# EAGLE design Main Board v2 (EAGLE 9.6.2)

## Sheet 1 of 2: High Power
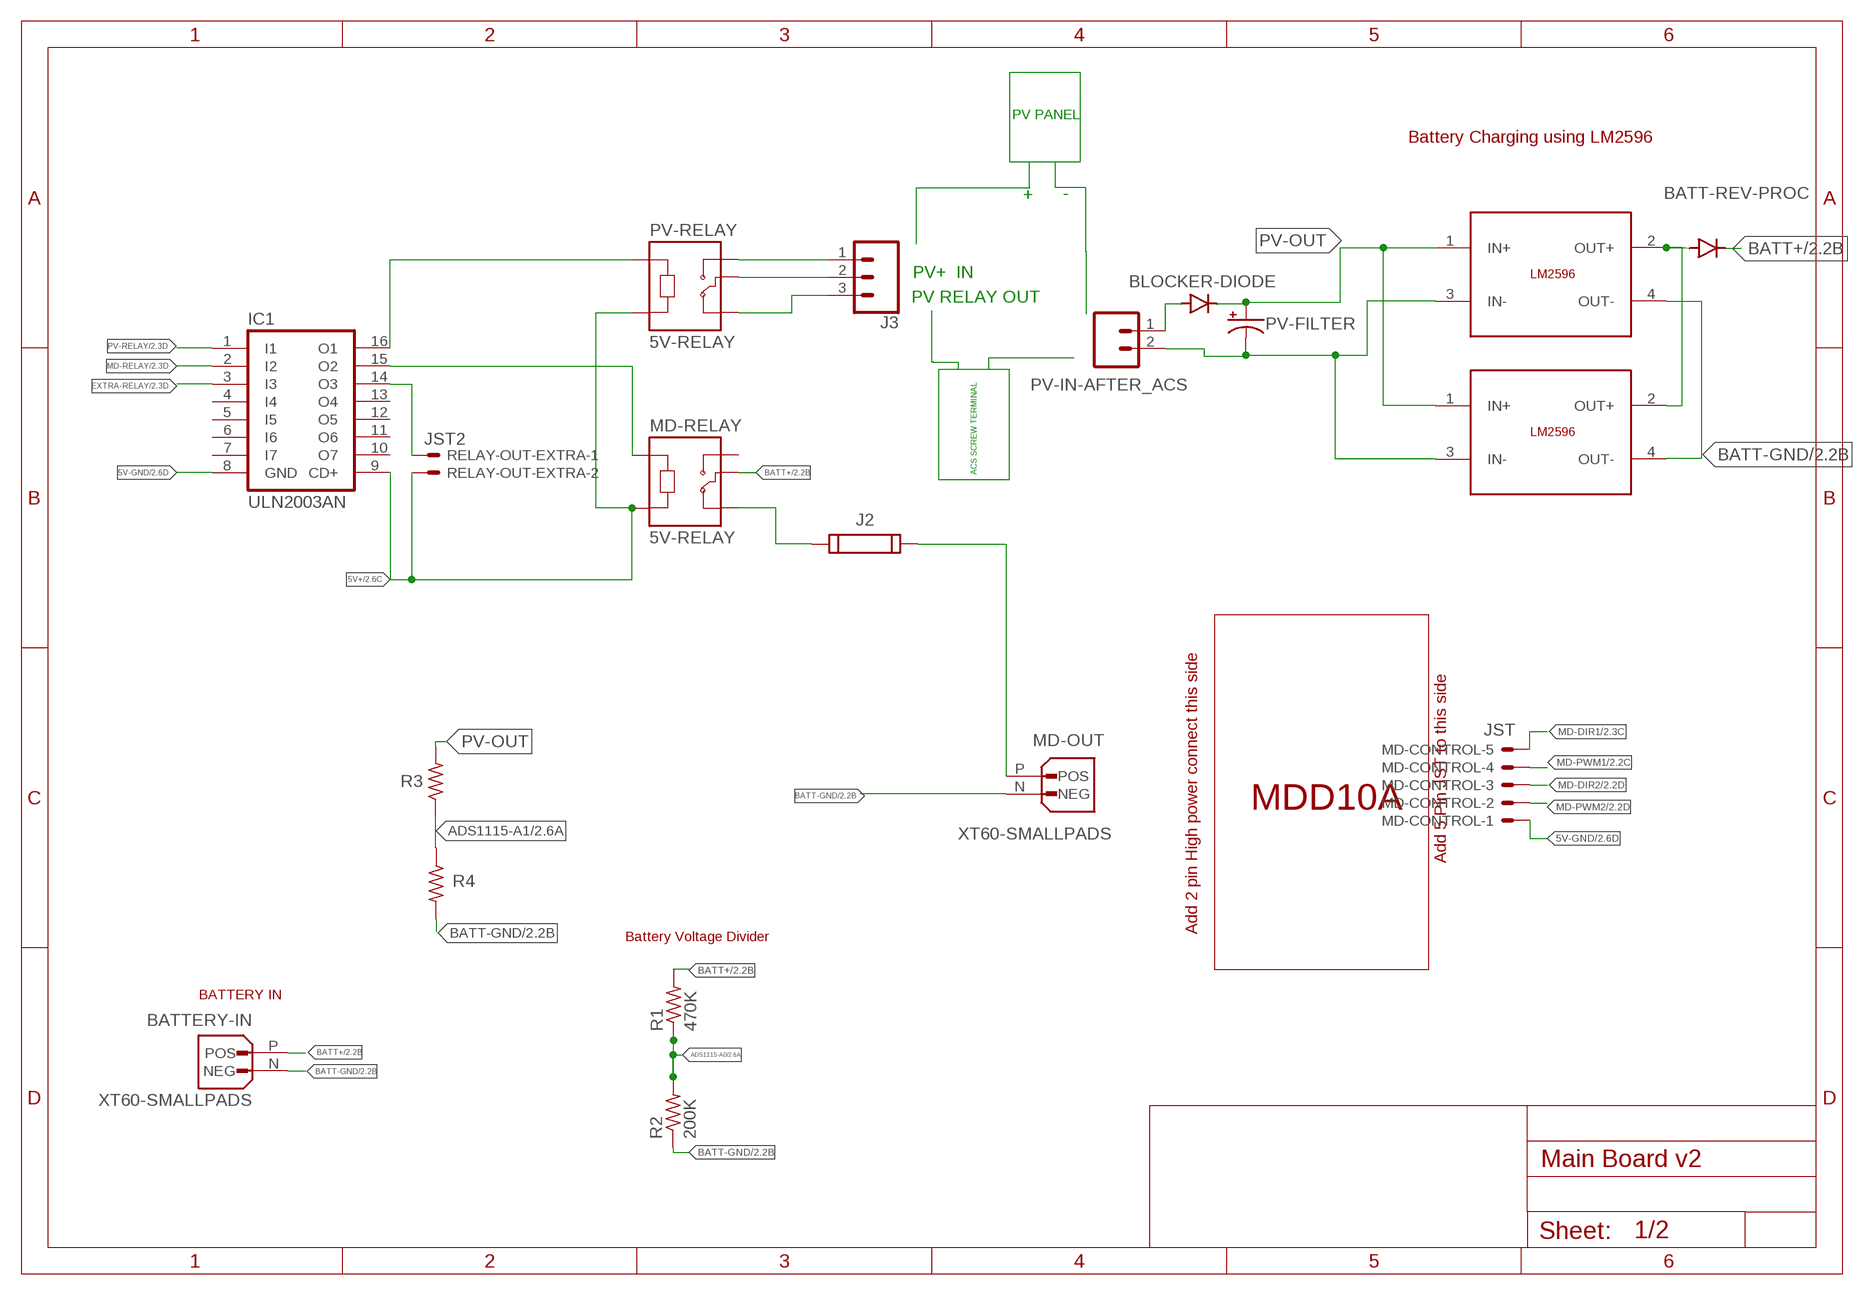
[diagram p0: schematic, sheet 1]

### Parts
BATT-REV-PROC  1N5400  [DO201-15]
BATTERY-IN  XT60-SMALLPADS  [XT-60-SMALLPADS]
BLOCKER-DIODE  1N5400  [DO201-15]
IC1  ULN2003AN  [DIL16]
J2  696101000002  [696101000002]
J3  CONN_03SCREW_LOCK  [SCREWTERMINAL-3.5MM-3_LOCK.007S]
MD-CONTROL  JST  JST-XH-05-PIN-LONG-PAD  [JST-XH-05-PACKAGE-LONG-PAD]
MD-OUT  XT60-SMALLPADS  [XT-60-SMALLPADS]
MD-RELAY  5V-RELAY  [RELAY-SRD-05VDC-SL-C]
PV-FILTER  CPOL-USE5-6  [E5-6]
PV-IN-AFTER_ACS  CONN_023.5MM  [SCREWTERMINAL-3.5MM-2]
PV-RELAY  5V-RELAY  [RELAY-SRD-05VDC-SL-C]
R1  470K  R-US_0309/12  [0309/12]
R2  200K  R-US_0309/12  [0309/12]
R3  R-US_0309/12  [0309/12]
R4  R-US_0309/12  [0309/12]
RELAY-OUT-EXTRA  JST2  JST-XH-02-PIN-LONG-PAD  [JST-XH-02-PACKAGE-LONG-PAD]
U$1  LM2596-MODULE  [LM2596-MODULE]
U$2  LM2596-MODULE  [LM2596-MODULE]
U$7  MDD10A-MODULE  [MDD10A]

### Nets
5V+: IC1.9(CD+) MD-RELAY.A2 PV-RELAY.A2 RELAY-OUT-EXTRA.2 ; also sheet 2
5V-GND: IC1.8(GND) MD-CONTROL.1 ; also sheet 2
ADS1115-A0: R1.1 R2.2 ; also sheet 2
ADS1115-A1: R3.1 R4.1 ; also sheet 2
BATT+: BATT-REV-PROC.C BATTERY-IN.P(POS) MD-RELAY.COM R1.2 ; also sheet 2
BATT-GND: BATTERY-IN.N(NEG) MD-OUT.N(NEG) R2.1 R4.2 U$1.4(OUT-) U$2.4(OUT-) ; also sheet 2
EXTRA-RELAY: IC1.3(I3) ; also sheet 2
MD-DIR1: MD-CONTROL.5 ; also sheet 2
MD-DIR2: MD-CONTROL.3 ; also sheet 2
MD-PWM1: MD-CONTROL.4 ; also sheet 2
MD-PWM2: MD-CONTROL.2 ; also sheet 2
MD-RELAY: IC1.2(I2) ; also sheet 2
N$1: J2.2 MD-OUT.P(POS)
N$2: IC1.14(O3) RELAY-OUT-EXTRA.1
N$3: J3.1 PV-RELAY.NO
N$4: J3.2 PV-RELAY.COM
N$5: J2.1 MD-RELAY.NC
N$13: BLOCKER-DIODE.A PV-IN-AFTER_ACS.1
N$14: PV-FILTER.- PV-IN-AFTER_ACS.2 U$1.3(IN-) U$2.3(IN-)
N$16: BATT-REV-PROC.A U$1.2(OUT+) U$2.2(OUT+)
N$23: J3.3 PV-RELAY.NC
N$63: IC1.16(O1) PV-RELAY.A1
N$85: IC1.15(O2) MD-RELAY.A1
PV-OUT: BLOCKER-DIODE.C PV-FILTER.+ R3.2 U$1.1(IN+) U$2.1(IN+)
PV-RELAY: IC1.1(I1) ; also sheet 2
Unconnected: IC1.4(I4) IC1.5(I5) IC1.6(I6) IC1.7(I7) IC1.10(O7) IC1.11(O6) IC1.12(O5) IC1.13(O4) MD-RELAY.NO

### Notes on the sheet
- PV PANEL
- Battery Charging using LM2596
- + | -
- PV+  IN
- PV RELAY OUT
- ACS SCREW TERMINAL
- Battery Voltage Divider
- BATTERY IN

## Sheet 2 of 2: Embedded Systems
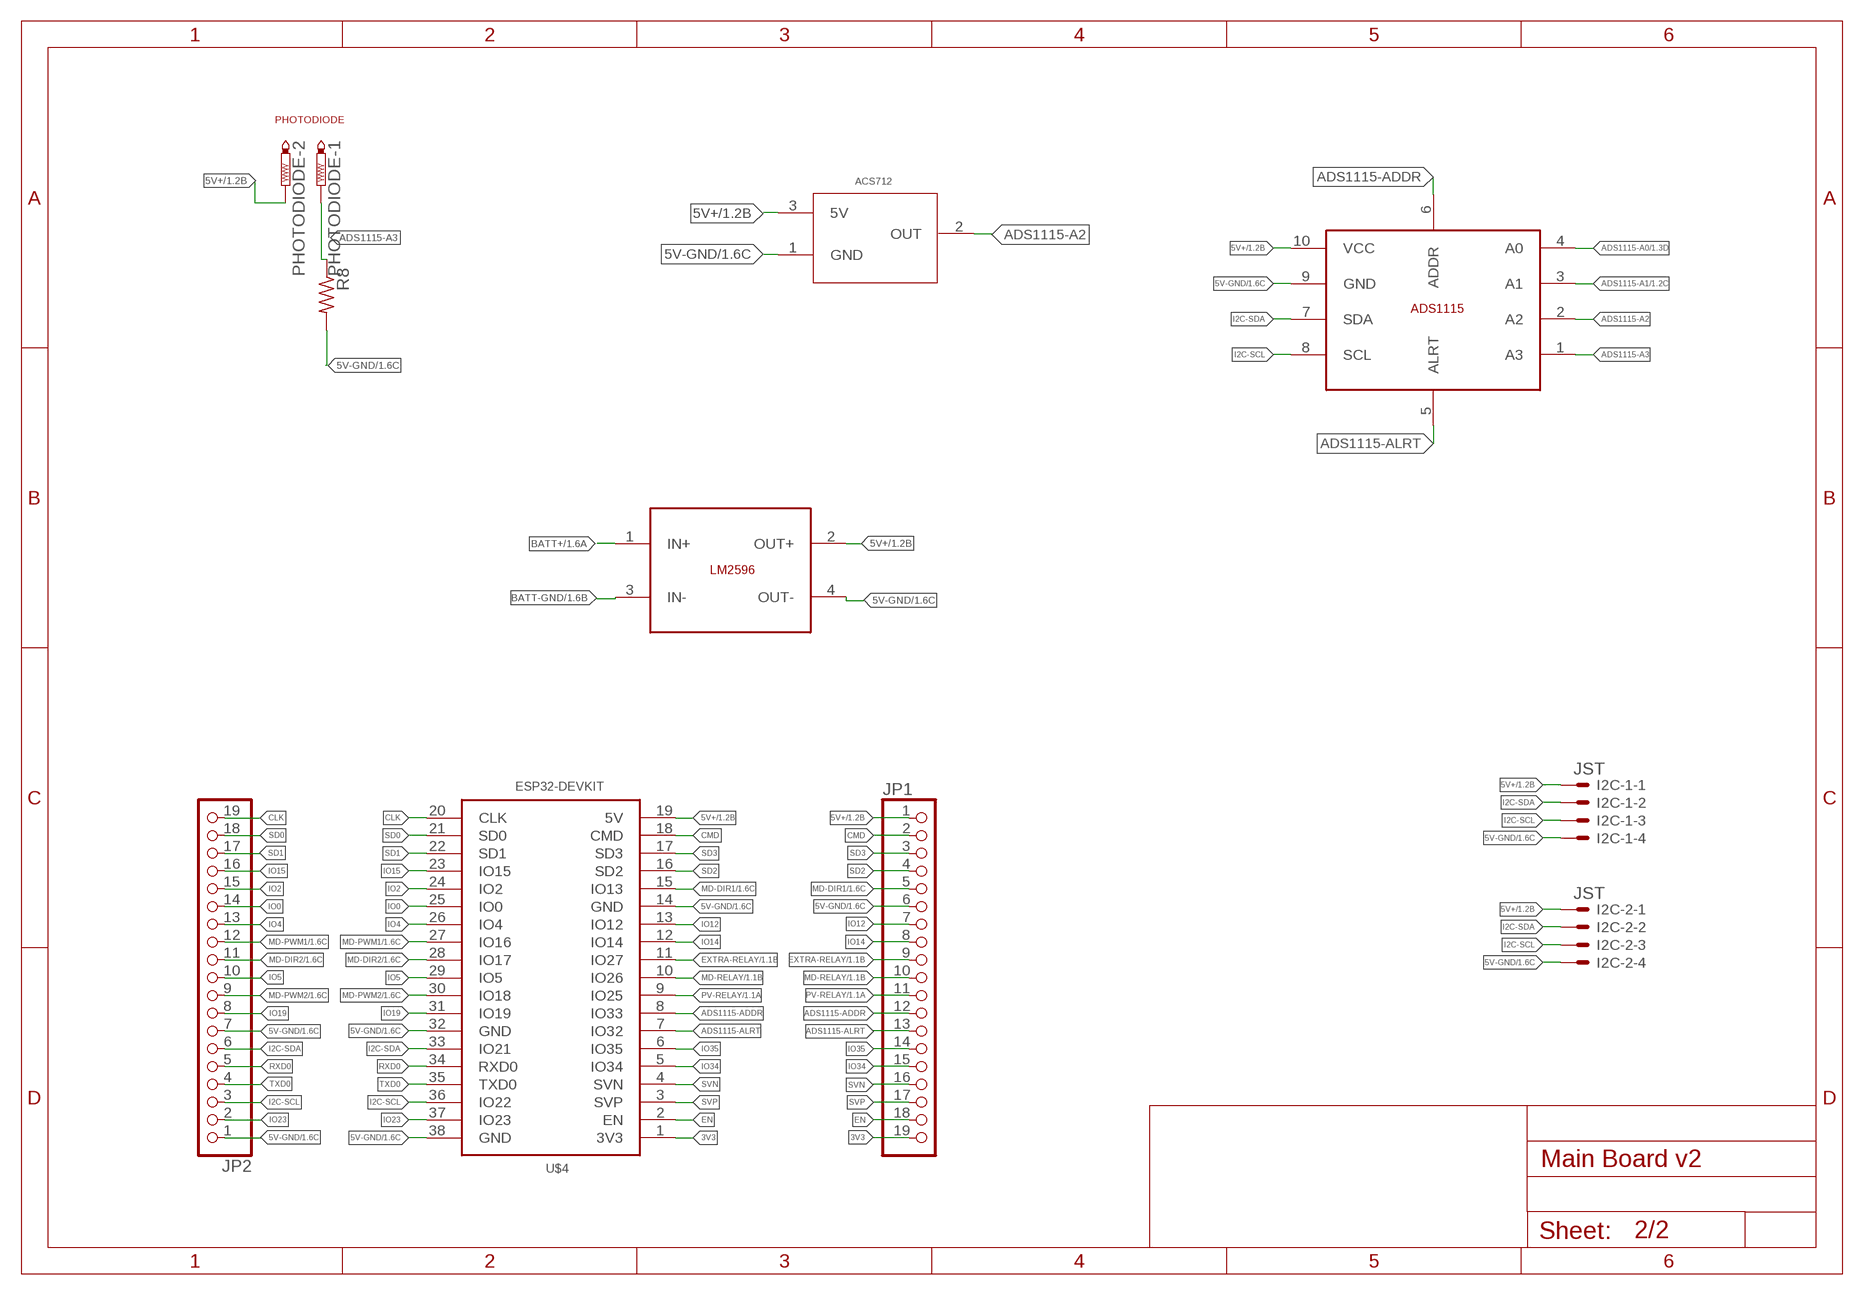
[diagram p1: schematic, sheet 2]

### Parts
I2C-1  JST  JST-XH-04-PIN-LONG-PAD  [JST-XH-04-PACKAGE-LONG-PAD]
I2C-2  JST  JST-XH-04-PIN-LONG-PAD  [JST-XH-04-PACKAGE-LONG-PAD]
JP1  PINHD-1X19  [1X19]
JP2  PINHD-1X19  [1X19]
PHOTODIODE  PTR2  [P2-38-17]
R8  R-US_0309/12  [0309/12]
U$4  ESP32-DEVKIT  [ESP32-38PINS]
U$5  ACS712-MODULE  [ACS712-MODULE]
U$6  ADS1115-MODULE  [ADS1115-MODULE]
U$8  LM2596-MODULE  [LM2596-MODULE]

### Nets
3V3: JP1.19 U$4.1(3V3)
5V+: I2C-1.1 I2C-2.1 JP1.1 PHOTODIODE.TP-2 U$4.19(5V) U$5.3(5V) U$6.10(VCC) U$8.2(OUT+) ; also sheet 1
5V-GND: I2C-1.4 I2C-2.4 JP1.6 JP2.1 JP2.7 R8.2 U$4.14(GND) U$4.32(GND) U$4.38(GND) U$5.1(GND) U$6.9(GND) U$8.4(OUT-) ; also sheet 1
ADS1115-A0: U$6.4(A0) ; also sheet 1
ADS1115-A1: U$6.3(A1) ; also sheet 1
ADS1115-A2: U$5.2(OUT) U$6.2(A2)
ADS1115-A3: PHOTODIODE.TP-1 R8.1 U$6.1(A3)
ADS1115-ADDR: JP1.12 U$4.8(IO33) U$6.6(ADDR)
ADS1115-ALRT: JP1.13 U$4.7(IO32) U$6.5(ALRT)
BATT+: U$8.1(IN+) ; also sheet 1
BATT-GND: U$8.3(IN-) ; also sheet 1
CLK: JP2.19 U$4.20(CLK)
CMD: JP1.2 U$4.18(CMD)
EN: JP1.18 U$4.2(EN)
EXTRA-RELAY: JP1.9 U$4.11(IO27) ; also sheet 1
I2C-SCL: I2C-1.3 I2C-2.3 JP2.3 U$4.36(IO22) U$6.8(SCL)
I2C-SDA: I2C-1.2 I2C-2.2 JP2.6 U$4.33(IO21) U$6.7(SDA)
IO0: JP2.14 U$4.25(IO0)
IO2: JP2.15 U$4.24(IO2)
IO4: JP2.13 U$4.26(IO4)
IO5: JP2.10 U$4.29(IO5)
IO12: JP1.7 U$4.13(IO12)
IO14: JP1.8 U$4.12(IO14)
IO15: JP2.16 U$4.23(IO15)
IO19: JP2.8 U$4.31(IO19)
IO23: JP2.2 U$4.37(IO23)
IO34: JP1.15 U$4.5(IO34)
IO35: JP1.14 U$4.6(IO35)
MD-DIR1: JP1.5 U$4.15(IO13) ; also sheet 1
MD-DIR2: JP2.11 U$4.28(IO17) ; also sheet 1
MD-PWM1: JP2.12 U$4.27(IO16) ; also sheet 1
MD-PWM2: JP2.9 U$4.30(IO18) ; also sheet 1
MD-RELAY: JP1.10 U$4.10(IO26) ; also sheet 1
PV-RELAY: JP1.11 U$4.9(IO25) ; also sheet 1
RXD0: JP2.5 U$4.34(RXD0)
SD0: JP2.18 U$4.21(SD0)
SD1: JP2.17 U$4.22(SD1)
SD2: JP1.4 U$4.16(SD2)
SD3: JP1.3 U$4.17(SD3)
SVN: JP1.16 U$4.4(SVN)
SVP: JP1.17 U$4.3(SVP)
TXD0: JP2.4 U$4.35(TXD0)

### Notes on the sheet
- PHOTODIODE

## Library data of the parts
BATT-REV-PROC BLOCKER-DIODE = diode:1N5400: DIODE standard rectifier, 3 A, 50 V (Motorola)
BATTERY-IN MD-OUT = XT60-M:XT60-SMALLPADS
I2C-1 I2C-2 = JST XH Connectors:JST-XH-04-PIN: JST XH Connector 2 Pin Wire to board connector. Pitch: 2,54 mm, (0.100") Number of pins: 4
IC1 = ULN2003A:ULN2003A: Darlington Array Check availability <https://pricing.snapeda.com/parts/ULN2003A/STMicroelectronics/view-part?ref=eda>; AVAILABILITY: In Stock; DESCRIPTION: DARLINGTON ARRAY 7NPN, 2003, DIP16; Transistor Polarity:NPN; Collector Emitter Voltage V(br)ceo:50V; DC Collector Current:500mA; DC Current Gain hFE:1000; Operating Temperature Range:-20°C to +85°C; Transistor Case Style:DIP; No. of Pins:16; SVHC:No SVHC (20-Jun-2011); Base Number:2003; Current Ic Continuous a Max:500mA; Device Marking:ULN2003A; IC Generic Number:2003; Input Type:TTL, CMOS 5V; Input Voltage Max:5V; Logic Function Number:2003; Module Configuration:Seven; No. of Channels:7; No. of Transistors:7; Operating Temperature Max:85°C; Operating Temperature Min:-20°C; Output Current Max:500mA; Output Type:Open Collector; Output Voltage Max:50V; Package / Case:DIP; Termination Type:Through Hole; Transistor Type:Power Darlington; MF: STMicroelectronics; MP: ULN2003A; PACKAGE: DIP-16 Sprague; PRICE: None; PURCHASE-URL: https://pricing.snapeda.com/search/part/ULN2003A/?ref=eda
J2 = Wurth_Connectors_WR-FSH:696101000002: WR-FSH Fuseholder THT Blocks PCB Clip Cover MATERIAL PROPERTIES Insulator Material PPO (PPE+PS) Insulator Flammability Rating UL94 V-1 Insulator Color Beige Contact Material Copper Alloy Contact Plating Tin over Nickel Contact Type Stamped GENERAL INFORMATION Operating Temperature -30 up to +120 °C Compliance RoHS ELECTRICAL PROPERTIES IR UL 18 A IR VDE 6.3 A Working Voltage [UL] 250 V (AC) Working Voltage [VDE] 250 V (AC) Withstanding Voltage [UL] 1500 V (AC) Withstanding Voltage [VDE] 1500 V (AC) Contact Resistance 10 mΩ MECHANICAL PROPERTIES Protection Class I & II Fuse Size 5x20 mm CERTIFICATION cULus Approval E157417 VDE Approval 129300 PACKAGING PROPERTIES Packaging Box <https://katalog.we-online.com/media/images/v2/o33101v209%20Family_WR-FSH_696101000002.jpg> Details see: https://katalog.we-online.com/en/em/FSH_THT_PCB_CLIP_COVER_696101000002 Updated by Ella Wu 2019-10-25 2019 (C) Wurth Elektronik; DATASHEET-URL: https://www.we-online.com/catalog/datasheet/696101000002.pdf; IR-UL: 18A; IR-VDE: 6.3A; MATES: 696120004001; PART-NUMBER: 696101000002; VALUE: 696101000002
J3 = SparkFun-Connectors:CONN_03: Multi connection point. Often used as Generic Header-pin footprint for 0.1 inch spaced/style header connections On any of the 0.1 inch spaced packages, you can populate with these: Break Away Headers - Straight <https://www.sparkfun.com/products/116> (PRT-00116) Break Away Male Headers - Right Angle <https://www.sparkfun.com/products/553> (PRT-00553) Female Headers <https://www.sparkfun.com/products/115> (PRT-00115) Break Away Headers - Machine Pin <https://www.sparkfun.com/products/117> (PRT-00117) Break Away Female Headers - Swiss Machine Pin <https://www.sparkfun.com/products/743> (PRT-00743) Stackable Header - 3 Pin (Female, 0.1") <https://www.sparkfun.com/products/13875> (PRT-13875) For SCREWTERMINALS and SPRING TERMINALS visit here: Screw Terimnals on SparkFun.com <https://www.sparkfun.com/search/results?term=Screw+Terminals> (5mm/3.5mm/2.54mm spacing) This device is also useful as a general connection point to wire up your design to another part of your project. Our various solder wires solder well into these plated through hole pads. Hook-Up Wire - Assortment (Stranded, 22 AWG) <https://www.sparkfun.com/products/11375> (PRT-11375) Hook-Up Wire - Assortment (Solid Core, 22 AWG) <https://www.sparkfun.com/products/11367> (PRT-11367) View the entire wire category on our website here <https://www.sparkfun.com/categories/141> Special notes: Molex polarized connector foot print use with SKU : PRT-08232 with associated crimp pins and housings.; PROD_ID: CONN-08288; SF_ID: PRT-08235
JP1 JP2 = pinhead:PINHD-1X19: PIN HEADER
MD-CONTROL = JST XH Connectors:JST-XH-05-PIN: JST XH Connector 2 Pin Wire to board connector. Pitch: 2,54 mm, (0.100") Number of pins: 5
MD-RELAY PV-RELAY = 5V Relay:5V-RELAY: SRD-05VDC-SL-C 5V Trigger Relay Module For Arduino And Raspberry Pi 5V Trigger Relay Module For Arduino And Raspberry Pi Check availability <https://pricing.snapeda.com/parts/SRD-05VDC-SL-C/Songle%20Relay/view-part?ref=eda> Dimensions : 19.1x15.1x15.3 mm (LxWxH); AVAILABILITY: Not in stock; DESCRIPTION: 5V Trigger Relay Module For Arduino And Raspberry Pi 5V Trigger Relay Module For Arduino And Raspberry Pi; MF: Songle Relay; MP: SRD-05VDC-SL-C; PACKAGE: NON STANDARD-5 Songle Relay; PRICE: None
PHOTODIODE = testpad:PTR2: TEST PIN
PV-FILTER = rcl:CPOL-US: POLARIZED CAPACITOR, American symbol; SPICEPREFIX: C
PV-IN-AFTER_ACS = SparkFun-Connectors:CONN_02: Multi connection point. Often used as Generic Header-pin footprint for 0.1 inch spaced/style header connections On any of the 0.1 inch spaced packages, you can populate with these: Break Away Headers - Straight <https://www.sparkfun.com/products/116> (PRT-00116) Break Away Male Headers - Right Angle <https://www.sparkfun.com/products/553> (PRT-00553) Female Headers <https://www.sparkfun.com/products/115> (PRT-00115) Break Away Headers - Machine Pin <https://www.sparkfun.com/products/117> (PRT-00117) Break Away Female Headers - Swiss Machine Pin <https://www.sparkfun.com/products/743> (PRT-00743) For SCREWTERMINALS and SPRING TERMINALS visit here: Screw Terimnals on SparkFun.com <https://www.sparkfun.com/search/results?term=Screw+Terminals> (5mm/3.5mm/2.54mm spacing) This device is also useful as a general connection point to wire up your design to another part of your project. Our various solder wires solder well into these plated through hole pads. Hook-Up Wire - Assortment (Stranded, 22 AWG) <https://www.sparkfun.com/products/11375> (PRT-11375) Hook-Up Wire - Assortment (Solid Core, 22 AWG) <https://www.sparkfun.com/products/11367> (PRT-11367) View the entire wire category on our website here <https://www.sparkfun.com/categories/141> Special notes: Molex polarized connector foot print use with: PRT-08233 with associated crimp pins and housings. 2.54_SCREWTERM for use with PRT-10571. 3.5mm Screw Terminal footprints for PRT-08084 5mm Screw Terminal footprints for use with PRT-08432; PROD_ID: CONN-08399
R1-R4 R8 = rcl:R-US_: RESISTOR, American symbol; SPICEPREFIX: R
RELAY-OUT-EXTRA = JST XH Connectors:JST-XH-02-PIN: JST XH Connector 2 Pin Wire to board connector. Pitch: 2,54 mm, (0.100") Number of pins: 2
U$1 U$2 U$8 = LM2596 Module:LM2596-MODULE
U$4 = ESP32 Devkit:ESP32-DEVKIT: ESP32 Devkit 38 GPIO Pins Specifications: Single or Dual-Core 32-bit LX6 Microprocessor with clock frequency up to 240 MHz. 520 KB of SRAM, 448 KB of ROM and 16 KB of RTC SRAM. Supports 802.11 b/g/n Wi-Fi connectivity with speeds up to 150 Mbps. Support for both Classic Bluetooth v4.2 and BLE specifications. 34 Programmable GPIOs. Up to 18 channels of 12-bit SAR ADC and 2 channels of 8-bit DAC. Serial Connectivity include 4 x SPI, 2 x I2C, 2 x I2S, 3 x UART. Ethernet MAC for physical LAN Communication (requires external PHY). 1 Host controller for SD/SDIO/MMC and 1 Slave controller for SDIO/SPI. Motor PWM and up to 16-channels of LED PWM. Secure Boot and Flash Encryption. Cryptographic Hardware Acceleration for AES, Hash (SHA-2), RSA, ECC and RNG.
U$5 = ACS712 Module:ACS712-MODULE
U$6 = ADS1115 MODULE:ADS1115-MODULE
U$7 = MDD10A Module:MDD10A-MODULE: This device is to place a MDD10A module on the top/bottom of the PCB using standoff's. You are supposed to have JST/Equivalent connector to connect the MD to the PCB. Similarly you have to have a 2 large pads on the other side to power the MD.

## Board
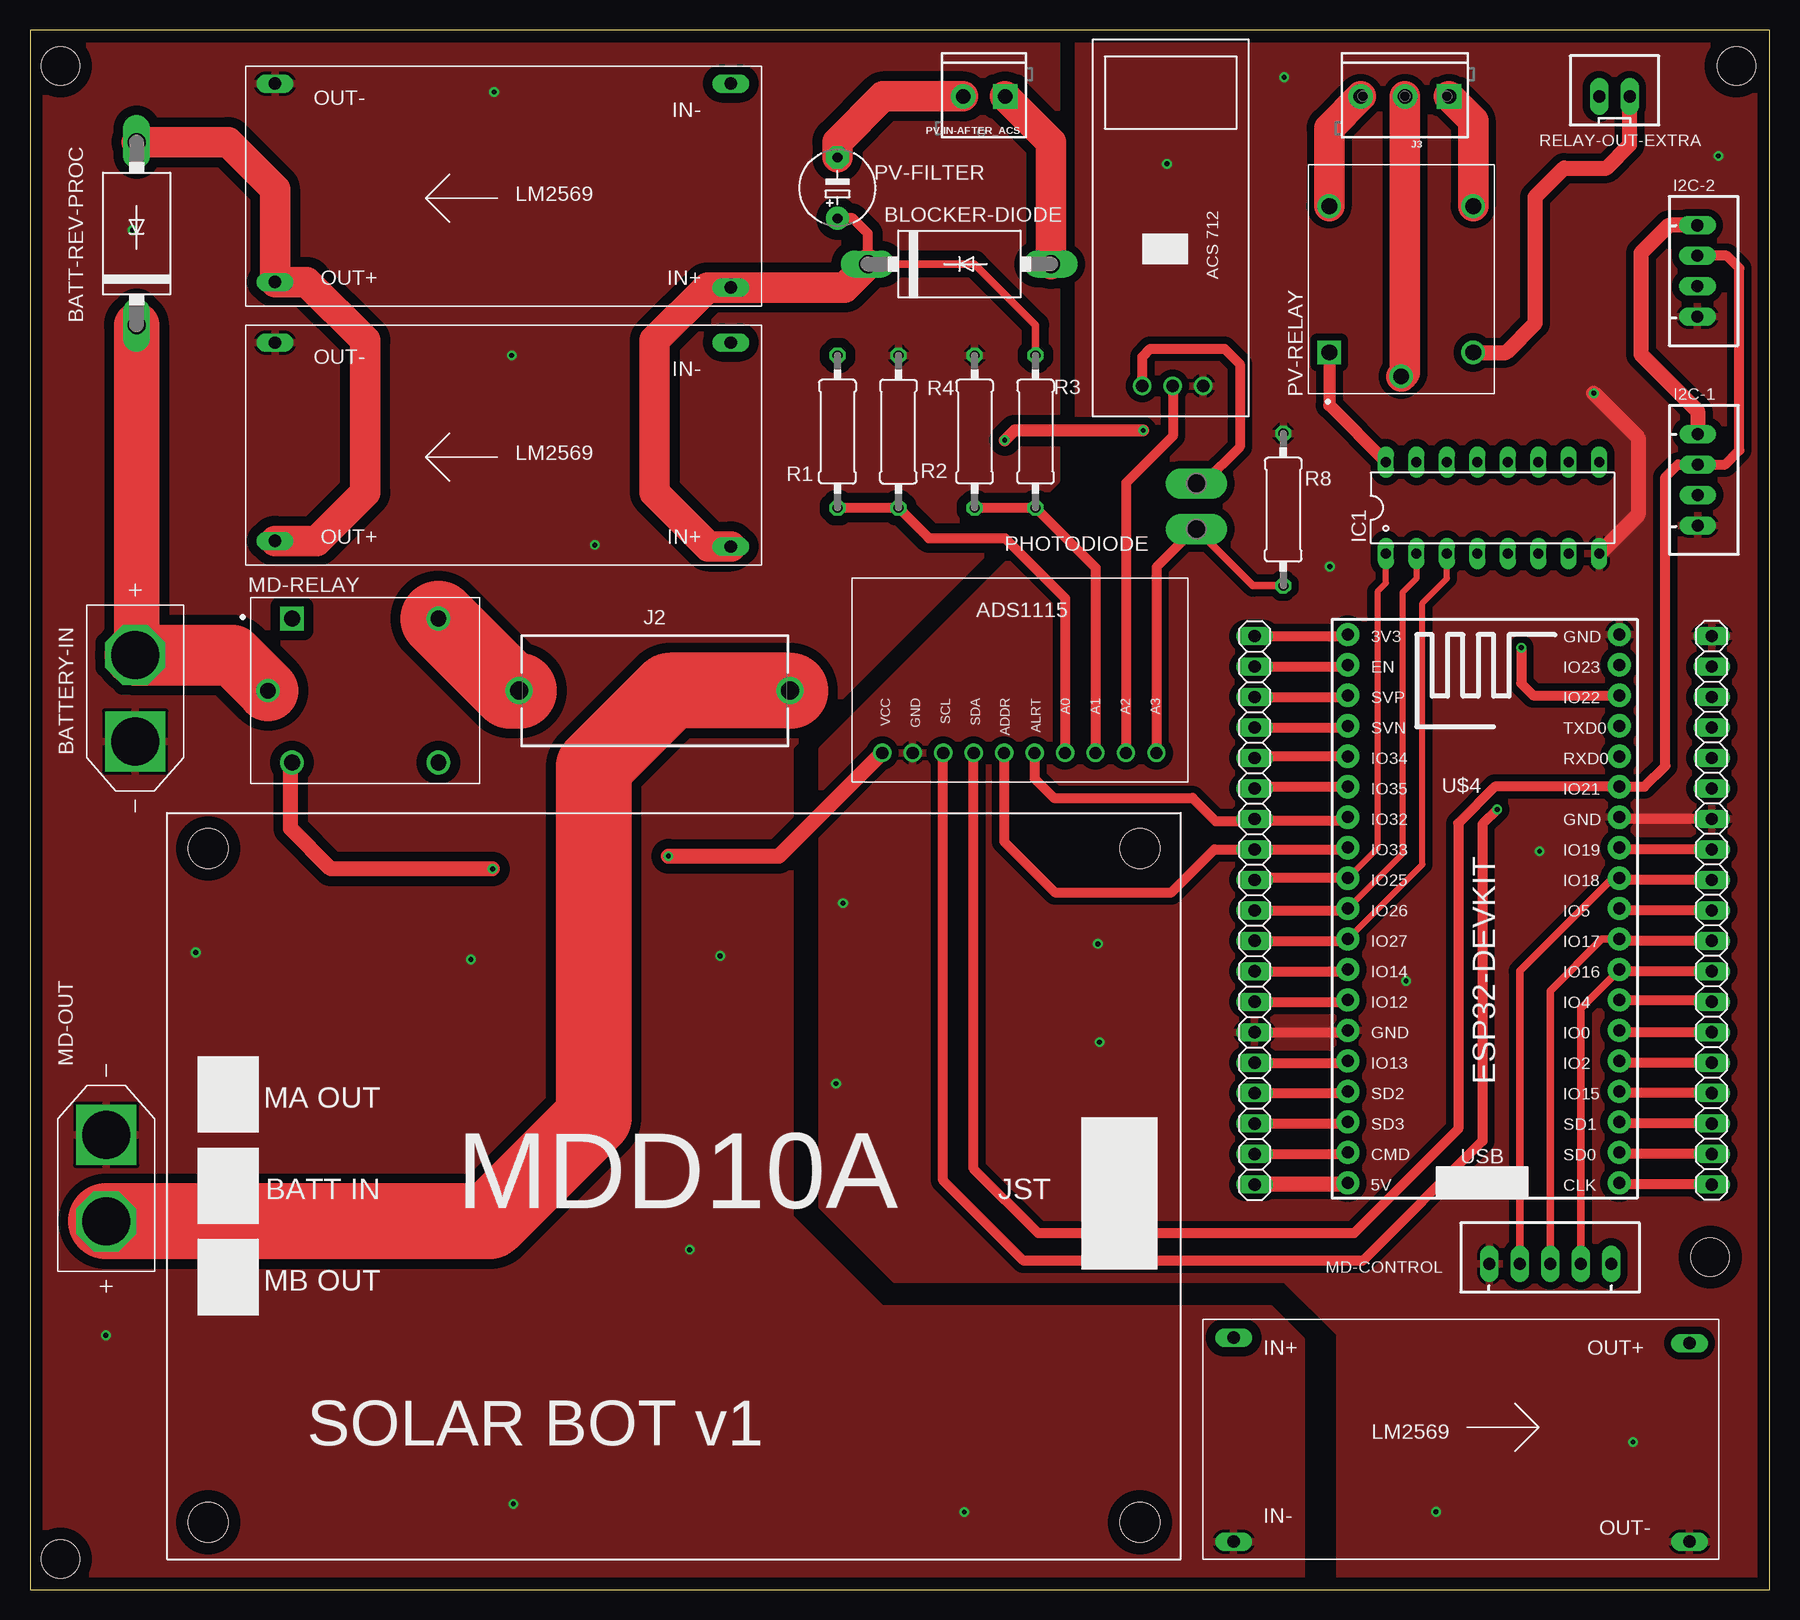
[diagram p2: board, top side]
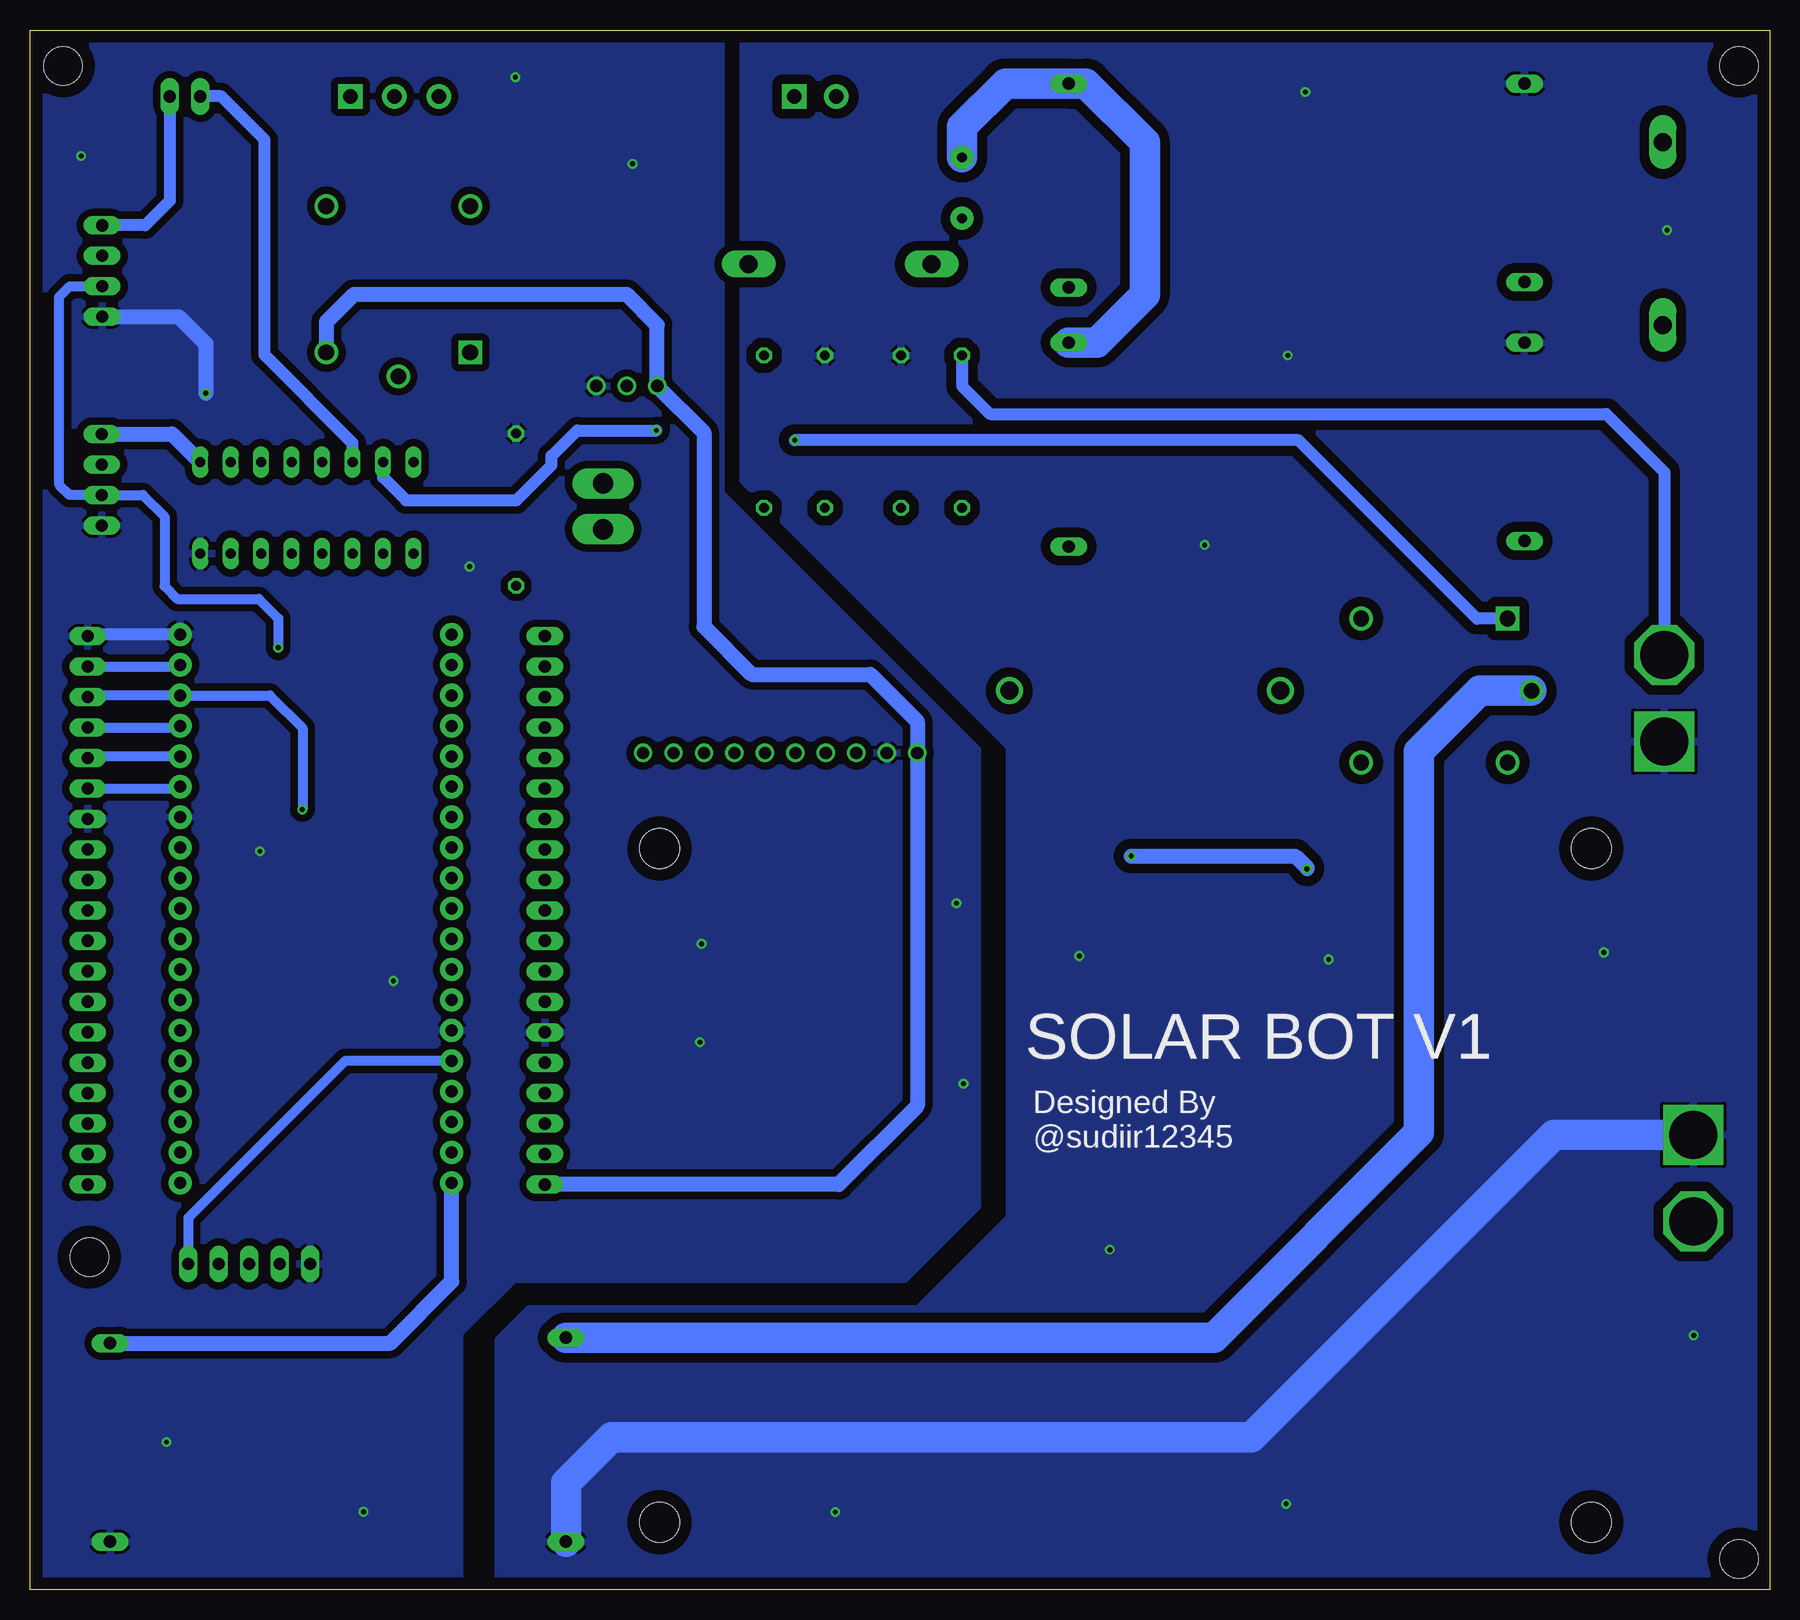
[diagram p3: board, bottom side, seen from below]

Size 145 x 130 mm. Coordinates in mm from the lower left corner, seen from the top.
Outline: 0,0 145,0 145,130 0,130 0,0
Copper layers (1*16): Top 0.035mm / dielectric 1.5mm / Bottom 0.035mm
Design rules "default": minimum track width 6mil, minimum drill 0.35mm, track to track 6mil, track to pad 6mil, pad to pad 6mil, via to via 6mil, smd to smd 6mil, copper to edge 40mil, drill to drill 6mil, minimum pad ring 10mil, minimum via ring 8mil, stop-mask expansion 4mil, vias tented up to drill 0mil, thermal gap 10mil
Holes 3.2 mm at 140.06,27.71 2.54,2.54 2.54,127 142.24,127

### Footprints (pad centres in the part's own frame; a part is rotated, then mirrored left to right if it is on the bottom)
DO201-15 = drill 1.499 long: A 7.62,0; C -7.62,0
XT-60-SMALLPADS = drill 4 pad 5 square: N 3.6,0 | drill 4 pad 5 octagon: P -3.6,0
JST-XH-04-PACKAGE-LONG-PAD = drill 1.016 long: 1 -3.81,0; 2 -1.27,0; 3 1.27,0; 4 3.81,0
DIL16 = drill 0.813 long: 1 -8.89,-3.81; 2 -6.35,-3.81; 3 -3.81,-3.81; 4 -1.27,-3.81; 5 1.27,-3.81; 6 3.81,-3.81; 7 6.35,-3.81; 8 8.89,-3.81; 9 8.89,3.81; 10 6.35,3.81; 11 3.81,3.81; 12 1.27,3.81; 13 -1.27,3.81; 14 -3.81,3.81; 15 -6.35,3.81; 16 -8.89,3.81
696101000002 = drill 1.5: 1 -11.3,0; 2 11.3,0
SCREWTERMINAL-3.5MM-3_LOCK.007S = drill 1.2 pad 2.032 square: 1 -0.178,0 | drill 1.2 pad 2.032: 2 3.5,0; 3 7.178,0
1X19 = drill 1.016 long: 1 -22.86,0; 2 -20.32,0; 3 -17.78,0; 4 -15.24,0; 5 -12.7,0; 6 -10.16,0; 7 -7.62,0; 8 -5.08,0; 9 -2.54,0; 10 0,0; 11 2.54,0; 12 5.08,0; 13 7.62,0; 14 10.16,0; 15 12.7,0; 16 15.24,0; 17 17.78,0; 18 20.32,0; 19 22.86,0
JST-XH-05-PACKAGE-LONG-PAD = drill 1.016 long: 1 -5.08,0; 2 -2.54,0; 3 0,0; 4 2.54,0; 5 5.08,0
RELAY-SRD-05VDC-SL-C = drill 1.32 square: A1 -6.1,6 | drill 1.32: A2 -6.1,-6; NC 6.1,6; NO 6.1,-6 | drill 1.29: COM -8.1,0
P2-38-17 = drill 1.702 pad 2.121 long: TP-1 -1.905,0; TP-2 1.905,0
E5-6 = drill 0.813 pad 1.905: + -2.54,0 | drill 0.813 pad 1.905 octagon: - 2.54,0
SCREWTERMINAL-3.5MM-2 = drill 1.2 pad 2.032 square: 1 0,0 | drill 1.2 pad 2.032: 2 3.5,0
0309/12 = drill 0.813 octagon: 1 -6.35,0; 2 6.35,0
JST-XH-02-PACKAGE-LONG-PAD = drill 1.016 long: 1 -1.27,0; 2 1.27,0
LM2596-MODULE = drill 1.016 long: 1 2.54,18.46; 2 40.54,18; 3 2.54,1.46; 4 40.54,1.46
ESP32-38PINS = drill 1 pad 1.93: 1 1.408,47.131; 2 1.408,44.591; 3 1.408,42.051; 4 1.408,39.511; 5 1.408,36.971; 6 1.408,34.431; 7 1.408,31.891; 8 1.408,29.351; 9 1.408,26.811; 10 1.408,24.271; 11 1.408,21.731; 12 1.408,19.191; 13 1.408,16.651; 14 1.408,14.111; 15 1.408,11.571; 16 1.408,9.031; 17 1.408,6.491; 18 1.408,3.951; 19 1.408,1.411; 20 24.058,1.411; 21 24.058,3.951; 22 24.058,6.491; 23 24.058,9.031; 24 24.058,11.571; 25 24.058,14.111; 26 24.058,16.651; 27 24.058,19.191; 28 24.058,21.731; 29 24.058,24.271; 30 24.058,26.811; 31 24.058,29.351; 32 24.058,31.891; 33 24.058,34.431; 34 24.058,36.971; 35 24.058,39.511; 36 24.058,42.051; 37 24.058,44.591; 38 24.058,47.131
ACS712-MODULE = drill 1.016: 1 2.54,3.81; 2 2.54,6.35; 3 2.54,8.89
ADS1115-MODULE = drill 1.016: 1 2.43,2.62; 2 2.43,5.16; 3 2.43,7.7; 4 2.43,10.24; 5 2.43,12.78; 6 2.43,15.32; 7 2.43,17.86; 8 2.43,20.4; 9 2.43,22.94; 10 2.43,25.48
MDD10A = hole 3.3: 81.09,3.06; 3.42,3.06; 3.42,59.22; 81.09,59.22

### Placement (x,y rotation side)
BATT-REV-PROC  8.89,113.03 90 top
BATTERY-IN  8.76,74.3 270 top
BLOCKER-DIODE  77.47,110.49 0 top
I2C-1  139.01,92.51 270 top
I2C-2  138.99,109.91 270 top
IC1  121.92,90.17 0 top
J2  52.07,74.93 0 top
J3  118.11,124.46 180 top
JP1  102.08,56.62 90 top
JP2  140.18,56.62 270 top
MD-CONTROL  126.72,27.15 0 top
MD-OUT  6.35,34.29 90 top
MD-RELAY  27.94,74.93 0 top
PHOTODIODE  97.23,90.3 90 top
PV-FILTER  67.31,116.84 90 top
PV-IN-AFTER_ACS  81.28,124.46 180 top
PV-RELAY  114.3,109.22 90 top
R1  67.31,96.52 90 top
R2  72.39,96.52 270 top
R3  83.82,96.52 90 top
R4  78.74,96.52 90 top
R8  104.47,90.02 90 top
RELAY-OUT-EXTRA  132.08,124.46 0 top
U$1  60.96,105.41 180 top
U$2  60.96,127 180 top
U$4  108.43,32.49 0 top
U$5  101.6,97.79 90 top
U$6  96.52,67.31 90 top
U$7  11.43,2.54 0 top
U$8  97.79,2.54 0 top

### Tracks (layer width: path | path; a pad name or v marks a point on that pad's centre or on a via)
3V3
  Top 0.813: JP1.19 109.7,79.48 U$4.1
5V+  (via drill 0.4)
  Top 0.813: U$5.3 92.71,102.77 93.37,103.43 99.57,103.43 100.84,102.16 100.84,95.25 97.79,92.2 PHOTODIODE.TP-2
  Top 1.27: PV-RELAY.A2 123.04,103.12 125.48,105.55 125.48,116.1 127.86,118.49 131.42,118.49 133.35,120.42 RELAY-OUT-EXTRA.2 | I2C-2.1 136.6,113.72 134.29,111.4 134.29,102.97 139.01,98.25 I2C-1.1 | U$4.19 109.7,33.76 JP1.1 | U$6.10 62.41,61.11 53.21,61.11 v53.21,61.14 | v38.56,60.07 25.07,60.07 21.72,63.42 21.72,68.81 MD-RELAY.A2
  Bottom 1.016: RELAY-OUT-EXTRA.2 133.35,115.77 135.41,113.72 I2C-2.1
  Bottom 1.27: PV-RELAY.A2 120.3,105.66 118.01,107.95 95.25,107.95 92.71,105.41 U$5.3 88.82,96.44 88.82,80.26 84.84,76.28 74.95,76.28 71.04,72.36 U$6.10 71.04,40.31 77.6,33.76 JP1.1 | U$8.2 114.97,20.54 109.84,25.67 U$4.19 | I2C-1.1 133.15,96.32 IC1.9 | v53.21,61.14 39.52,61.14 38.56,60.17 v38.56,60.07
5V-GND  (via drill 0.4)
  Top 0.813: JP1.6 109.7,46.46 U$4.14 | JP2.7 132.63,64.24 U$4.32
  Top 1.27: v130.35,99.72 134.06,96.01 134.06,89.61 IC1.8
  Bottom 1.016: U$4.38 140.04,79.62 JP2.1
  Bottom 1.27: I2C-2.4 132.59,106.1 130.35,103.86 v130.35,99.72
  other vias: 117.2,6.48 133.63,12.29 67.77,57.2 67.18,42.16 89.03,53.82 89.15,45.62 125.83,61.54 114.71,50.72 108.36,85.27 140.74,119.51 104.55,126.06 94.77,118.85
  pour Top (isolate 0.61): 87.38,131.72 87.38,91.39 66.01,70.03 66.01,31.95 66.19,31.78 72.11,25.86 103.53,25.86 104.65,25.86 109.17,21.34 109.17,-0.71 109.25,-0.79 145.52,-0.79 145.69,-0.61 145.69,130.73 145.62,130.81 88.29,130.81
  pour Bottom (isolate 0.61): 87.38,131.72 87.38,91.39 66.01,70.03 66.01,31.95 66.19,31.78 72.11,25.86 103.53,25.86 104.65,25.86 109.17,21.34 109.17,-0.71 109.25,-0.79 145.52,-0.79 145.69,-0.61 145.69,130.73 145.62,130.81 88.29,130.81
ADS1115-A0
  Top 0.813: R1.1 R2.2 74.93,87.63 81.28,87.63 86.28,82.63 U$6.4
ADS1115-A1
  Top 0.813: R4.1 R3.1 88.82,85.17 U$6.3
ADS1115-A2
  Top 0.813: U$5.2 95.25,96.14 91.36,92.25 U$6.2
ADS1115-A3
  Top 0.61: R8.1 101.96,83.67 PHOTODIODE.TP-1
  Top 0.813: PHOTODIODE.TP-1 96.96,88.27 93.9,85.21 U$6.1
ADS1115-ADDR
  Top 0.813: U$6.6 81.2,62.36 85.45,58.12 95.15,58.12 98.73,61.7 JP1.12 109.7,61.7 U$4.8
ADS1115-ALRT
  Top 0.813: U$6.5 83.74,67.59 85.34,65.99 96.9,65.99 98.83,64.06 101.91,64.06 | 101.91,64.06 JP1.13 | U$4.7 109.52,64.06 101.91,64.06
BATT+
  Top 3.81: BATT-REV-PROC.C 8.89,78.02 BATTERY-IN.P
  Top 5.08: BATTERY-IN.P 16.88,77.89 MD-RELAY.COM
  Bottom 1.016: R1.2 67.31,100.33 64.97,97.99 13.62,97.99 8.76,93.14 BATTERY-IN.P
  Bottom 2.54: MD-RELAY.COM 24.13,74.93 29.21,69.85 29.21,38.1 46.31,21 U$8.1
BATT-GND  (via drill 0.4)
  Bottom 2.54: MD-OUT.N 17.99,37.89 43.18,12.7 96.52,12.7 100.33,8.89 U$8.3
  other vias: 77.88,6.45 40.28,7.14 6.32,21.18 36.75,52.53 13.82,53.11 8.53,113.31 38.68,124.84 40.16,102.87 47.09,87.07 57.53,52.81 54.99,28.32
  pour Bottom (isolate 0.813): 85.57,131.7 85.57,92.46 63.35,70.23 63.35,31.04 70.41,23.98 70.99,23.39 103.4,23.39 105.97,20.83 105.97,-0.81 -0.81,-0.81 -1.4,-1.4 -1.4,131.37 -1.17,131.6 85.47,131.6
  pour Top (isolate 0.813): 85.57,131.7 85.57,92.46 63.35,70.23 63.35,31.04 70.41,23.98 70.99,23.39 103.4,23.39 105.97,20.83 105.97,-0.81 -0.81,-0.81 -1.4,-1.4 -1.4,131.37 -1.17,131.6 85.47,131.6
CLK
  Top 0.813: JP2.19 132.63,33.76 U$4.20
CMD
  Top 0.813: JP1.2 109.7,36.3 U$4.18
EN
  Top 0.813: JP1.18 109.7,76.94 U$4.2
EXTRA-RELAY
  Top 0.508: U$4.11 109.85,54.23 116.08,60.45 116.08,82.25 118.11,84.28 IC1.3
  Top 0.813: JP1.9 109.7,54.08 109.85,54.23
I2C-SCL  (via drill 0.4)
  Top 0.813: U$6.8 76.12,34.12 82.83,27.41 111.1,27.41 121.08,37.39 121.08,63.8 v122.3,65.02 | v124.31,78.51 124.31,75.54 125.31,74.54 U$4.36
  Bottom 0.813: I2C-2.3 141.68,108.64 142.54,107.77 142.54,92.08 141.71,91.24 I2C-1.3 135.59,91.24 133.78,89.43 133.78,83.64 132.72,82.58 125.93,82.58 124.31,80.95 v124.31,78.51 | JP2.3 140.04,74.54 U$4.36 125.01,74.54 122.28,71.81 122.28,65.05 v122.3,65.02
I2C-SDA
  Top 0.813: U$6.7 78.66,35.08 84.05,29.69 110.36,29.69 119.05,38.38 119.05,63.86 122.11,66.92 U$4.33 134.58,66.92 136.32,68.66 136.32,92.73 137.36,93.78 I2C-1.2 141.3,93.78 142.49,94.97 142.49,110.13 141.45,111.18 I2C-2.2
  Bottom 0.813: JP2.6 132.63,66.78 U$4.33
IO0
  Top 0.813: JP2.14 132.63,46.46 U$4.25
IO2
  Top 0.813: JP2.15 132.63,43.92 U$4.24
IO4
  Top 0.813: U$4.26 140.04,49.14 JP2.13
IO5
  Top 0.813: JP2.10 132.63,56.62 U$4.29
IO12
  Top 0.813: JP1.7 109.7,49 U$4.13
IO14
  Top 0.813: JP1.8 109.7,51.54 U$4.12
IO15
  Top 0.813: JP2.16 132.63,41.38 U$4.23
IO19
  Top 0.813: JP2.8 132.63,61.7 U$4.31
IO23
  Bottom 0.813: JP2.2 132.63,76.94 U$4.37
IO34
  Top 0.813: U$4.5 102.22,69.46 JP1.15
IO35
  Top 0.813: JP1.14 102.22,66.92 U$4.6
MD-DIR1
  Top 0.813: JP1.5 109.7,43.92 U$4.15
  Bottom 0.813: U$4.15 118.73,44.06 131.8,30.99 MD-CONTROL.5
MD-DIR2
  Top 0.61: U$4.28 131.03,54.22 126.72,49.91 MD-CONTROL.3
  Top 0.813: JP2.11 132.63,54.08 U$4.28
MD-PWM1
  Top 0.61: U$4.27 132.25,51.44 129.26,48.45 MD-CONTROL.4
  Top 0.813: JP2.12 132.35,51.54 132.25,51.44
MD-PWM2
  Top 0.61: U$4.30 131.93,59.3 124.18,51.55 MD-CONTROL.2
  Top 0.813: JP2.9 132.63,59.16 U$4.30
MD-RELAY
  Top 0.508: U$4.10 114.4,61.32 114.4,83.11 115.57,84.28 IC1.2
  Top 0.813: JP1.10 109.7,56.62 U$4.10
N$1
  Top 6.35: J2.2 53.34,74.93 46.99,68.58 46.99,39.37 38.31,30.69 MD-OUT.P
N$2
  Bottom 1.016: IC1.14 118.11,95.58 125.45,102.92 125.45,120.85 129.06,124.46 RELAY-OUT-EXTRA.1
N$3
  Top 2.54: J3.1 120.3,122.45 PV-RELAY.NO
N$4
  Top 2.54: J3.2 114.61,101.43 PV-RELAY.COM
N$5
  Top 6.35: J2.1 40.04,74.93 MD-RELAY.NC
N$13
  Top 2.54: PV-IN-AFTER_ACS.1 85.09,120.65 BLOCKER-DIODE.A
N$14
  Top 2.54: PV-IN-AFTER_ACS.2 71.12,124.46 67.31,120.65 PV-FILTER.-
  Bottom 2.54: PV-FILTER.- 67.31,121.92 63.69,125.54 U$2.3 56.96,125.54 52.07,120.65 52.07,107.95 56.07,103.95 U$1.3
N$16
  Top 2.54: U$1.2 23.91,87.41 27.94,91.44 27.94,104.14 23.08,109 U$2.2 20.42,116.74 16.51,120.65 BATT-REV-PROC.A
N$23
  Top 2.54: J3.3 108.3,121.83 PV-RELAY.NC
N$63
  Top 1.016: PV-RELAY.A1 108.3,98.71 IC1.16
N$85  (via drill 0.4)
  Top 1.016: v92.79,96.62 82.07,96.62 v81.25,95.81
  Bottom 1.016: MD-RELAY.A1 24.39,80.93 39.27,95.81 v81.25,95.81 | IC1.15 115.57,92.71 113.67,90.81 104.44,90.81 101.52,93.73 101.52,94.49 99.39,96.62 v92.79,96.62
PV-OUT
  Top 0.61: R3.2 83.82,105.41 78.74,110.49 BLOCKER-DIODE.C
  Top 0.813: BLOCKER-DIODE.C 69.85,113.03 68.58,114.3 PV-FILTER.+
  Top 2.54: BLOCKER-DIODE.C 67.9,108.54 U$2.1 56.47,108.54 52.07,104.14 52.07,91.44 56.56,86.95 U$1.1
PV-RELAY
  Top 0.508: U$4.9 112.32,61.77 112.32,83.19 113.03,83.9 IC1.1
  Top 0.813: U$4.9 102.22,59.3 JP1.11
RXD0
  Bottom 0.813: U$4.34 140.04,69.46 JP2.5
SD0
  Top 0.813: JP2.18 132.63,36.3 U$4.21
SD1
  Top 0.813: JP2.17 132.63,38.84 U$4.22
SD2
  Top 0.813: JP1.4 109.7,41.38 U$4.16
SD3
  Top 0.813: JP1.3 109.7,38.84 U$4.17
SVN
  Top 0.813: JP1.16 109.7,71.86 U$4.4
SVP
  Top 0.813: JP1.17 109.7,74.4 U$4.3
TXD0
  Bottom 0.813: JP2.4 132.63,71.86 U$4.35

### Text on the board
tPlace: SOLAR BOT v1
bPlace: SOLAR BOT V1 | Designed By / @sudiir12345